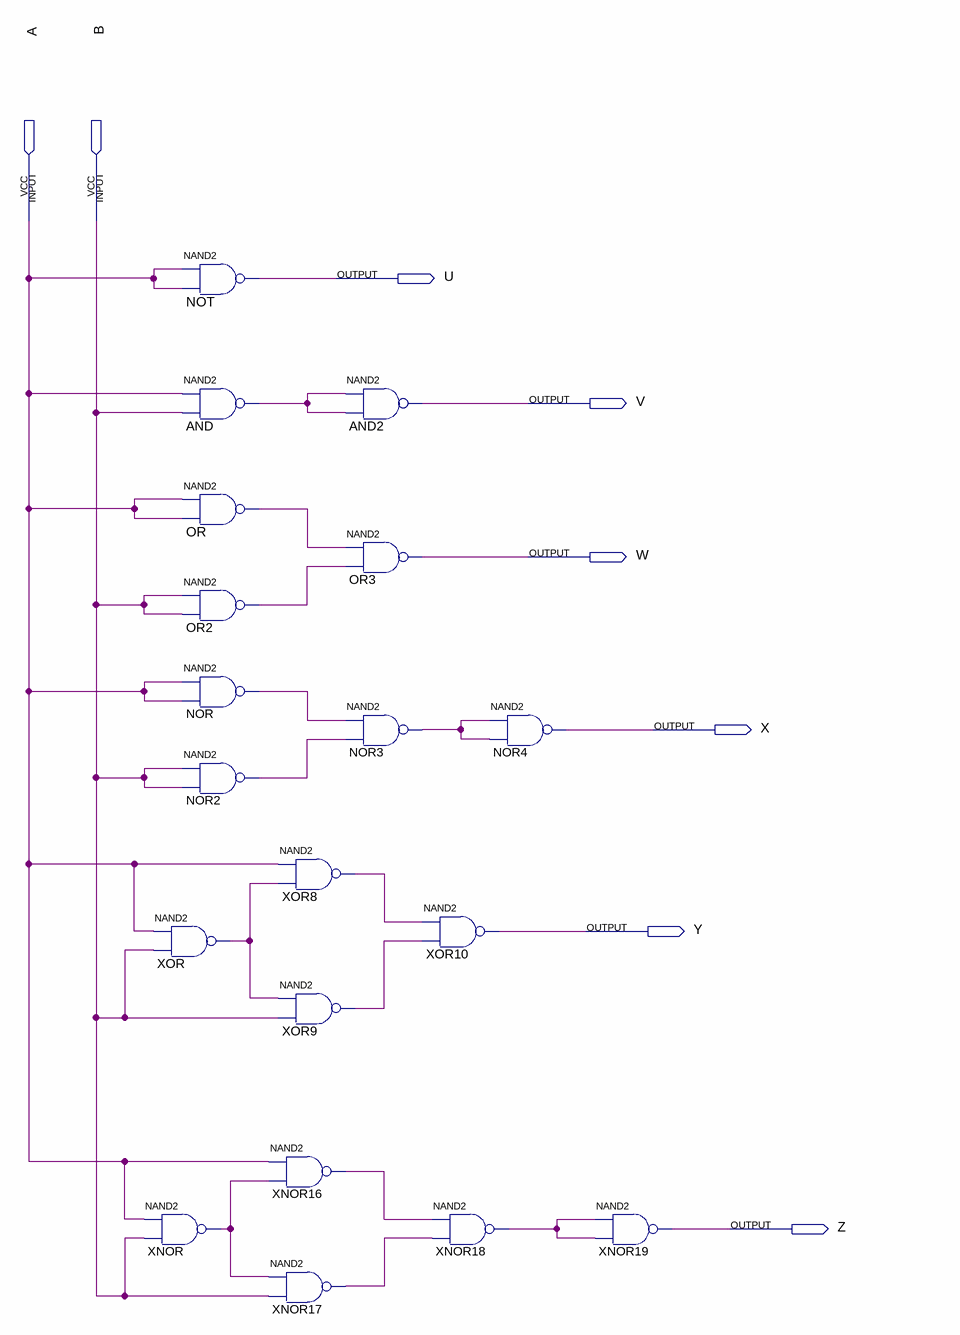
[diagram p0: schematic sheet]
// Quartus schematic Lab5.bdf as structural Verilog: 19 symbols, 8 pins
module Lab5 (
  input  A,
  input  B,
  output U,
  output V,
  output W,
  output X,
  output Y,
  output Z
);

  wire AND_out, NOR2_out, NOR3_out, NOR_out, OR2_out, OR_out, XNOR16_out, XNOR17_out, XNOR18_out, XNOR_out,
       XOR8_out, XOR9_out, XOR_out;

  nand XOR (XOR_out, A, B);
  nand XNOR (XNOR_out, A, B);
  nand NOT (U, A, A);
  nand AND (AND_out, A, B);
  nand OR (OR_out, A, A);
  nand OR2 (OR2_out, B, B);
  nand NOR (NOR_out, A, A);
  nand NOR2 (NOR2_out, B, B);
  nand XOR8 (XOR8_out, A, XOR_out);
  nand XOR9 (XOR9_out, XOR_out, B);
  nand XNOR16 (XNOR16_out, A, XNOR_out);
  nand XNOR17 (XNOR17_out, XNOR_out, B);
  nand AND2 (V, AND_out, AND_out);
  nand OR3 (W, OR_out, OR2_out);
  nand NOR3 (NOR3_out, NOR_out, NOR2_out);
  nand XOR10 (Y, XOR8_out, XOR9_out);
  nand XNOR18 (XNOR18_out, XNOR16_out, XNOR17_out);
  nand NOR4 (X, NOR3_out, NOR3_out);
  nand XNOR19 (Z, XNOR18_out, XNOR18_out);
endmodule
